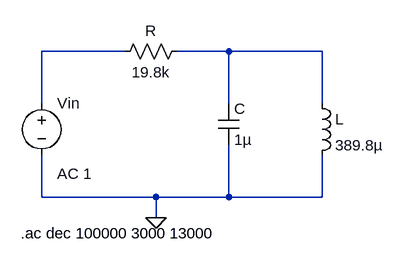
[diagram p0: schematic FILTRO - RLC.asc]
FILTRO - RLC.asc, the LTspice schematic file:
Version 4
SHEET 1 880 680
WIRE 144 144 16 144
WIRE 304 144 224 144
WIRE 448 144 304 144
WIRE 16 224 16 144
WIRE 304 224 304 144
WIRE 448 224 448 144
WIRE 16 368 16 304
WIRE 192 368 16 368
WIRE 304 368 304 288
WIRE 304 368 192 368
WIRE 448 368 448 304
WIRE 448 368 304 368
WIRE 192 400 192 368
FLAG 192 400 0
SYMBOL res 240 128 R90
WINDOW 0 0 56 VBottom 2
WINDOW 3 32 56 VTop 2
SYMATTR InstName R
SYMATTR Value 19.8k
SYMATTR SpiceLine tol=10
SYMBOL cap 288 224 R0
SYMATTR InstName C
SYMATTR Value 1µ
SYMBOL ind 432 208 R0
SYMATTR InstName L
SYMATTR Value 389.8µ
SYMBOL voltage 16 208 R0
WINDOW 123 24 124 Left 2
WINDOW 39 0 0 Left 0
SYMATTR Value2 AC 1
SYMATTR InstName Vin
SYMATTR Value ""
TEXT -16 424 Left 2 !.ac dec 100000 3000 13000

The netlist it stands for:
* FILTRO - RLC.asc
R N002 N001 19.8k tol=10
C N002 0 1µ
L N002 0 389.8µ
Vin N001 0 AC 1
.ac dec 100000 3000 13000
.backanno
.end